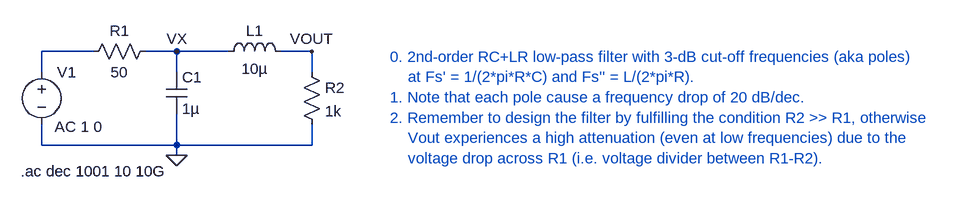
[diagram p0: schematic __LPF.asc]
__LPF.asc, the LTspice schematic file:
Version 4
SHEET 1 1572 680
WIRE 80 112 0 112
WIRE 208 112 160 112
WIRE 288 112 208 112
WIRE 416 112 368 112
WIRE 0 144 0 112
WIRE 208 144 208 112
WIRE 416 144 416 112
WIRE 0 256 0 224
WIRE 208 256 208 208
WIRE 208 256 0 256
WIRE 416 256 416 224
WIRE 416 256 208 256
WIRE 208 272 208 256
FLAG 208 272 0
FLAG 208 112 VX
FLAG 416 112 VOUT
SYMBOL cap 192 144 R0
SYMATTR InstName C1
SYMATTR Value 1µ
SYMBOL res 176 96 R90
WINDOW 0 0 56 VBottom 2
WINDOW 3 32 56 VTop 2
SYMATTR InstName R1
SYMATTR Value 50
SYMBOL ind 272 128 R270
WINDOW 0 32 56 VTop 2
WINDOW 3 5 56 VBottom 2
SYMATTR InstName L1
SYMATTR Value 10µ
SYMBOL res 400 128 R0
SYMATTR InstName R2
SYMATTR Value 1k
SYMBOL voltage 0 128 R0
WINDOW 123 20 100 Left 2
WINDOW 39 0 0 Left 2
WINDOW 3 24 96 Invisible 2
SYMATTR Value2 AC 1 0
SYMATTR InstName V1
SYMATTR Value 0
TEXT -32 296 Left 2 !.ac dec 1001 10 10G
TEXT 536 120 Left 2 ;0. 2nd-order RC+LR low-pass filter with 3-dB cut-off frequencies (aka poles)\n    at Fs' = 1/(2*pi*R*C) and Fs'' = L/(2*pi*R).\n1. Note that each pole cause a frequency drop of 20 dB/dec.\n2. Remember to design the filter by fulfilling the condition R2 >> R1, otherwise\n    Vout experiences a high attenuation (even at low frequencies) due to the\n    voltage drop across R1 (i.e. voltage divider between R1-R2).

The netlist it stands for:
* __LPF.asc
C1 VX 0 1µ
R1 VX N001 50
L1 VX VOUT 10µ
R2 VOUT 0 1k
V1 N001 0 0 AC 1 0
.ac dec 1001 10 10G
* 0. 2nd-order RC+LR low-pass filter with 3-dB cut-off frequencies (aka poles)
*     at Fs' = 1/(2*pi*R*C) and Fs'' = L/(2*pi*R).
* 1. Note that each pole cause a frequency drop of 20 dB/dec.
* 2. Remember to design the filter by fulfilling the condition R2 >> R1, otherwise
*     Vout experiences a high attenuation (even at low frequencies) due to the
*     voltage drop across R1 (i.e. voltage divider between R1-R2).
.backanno
.end